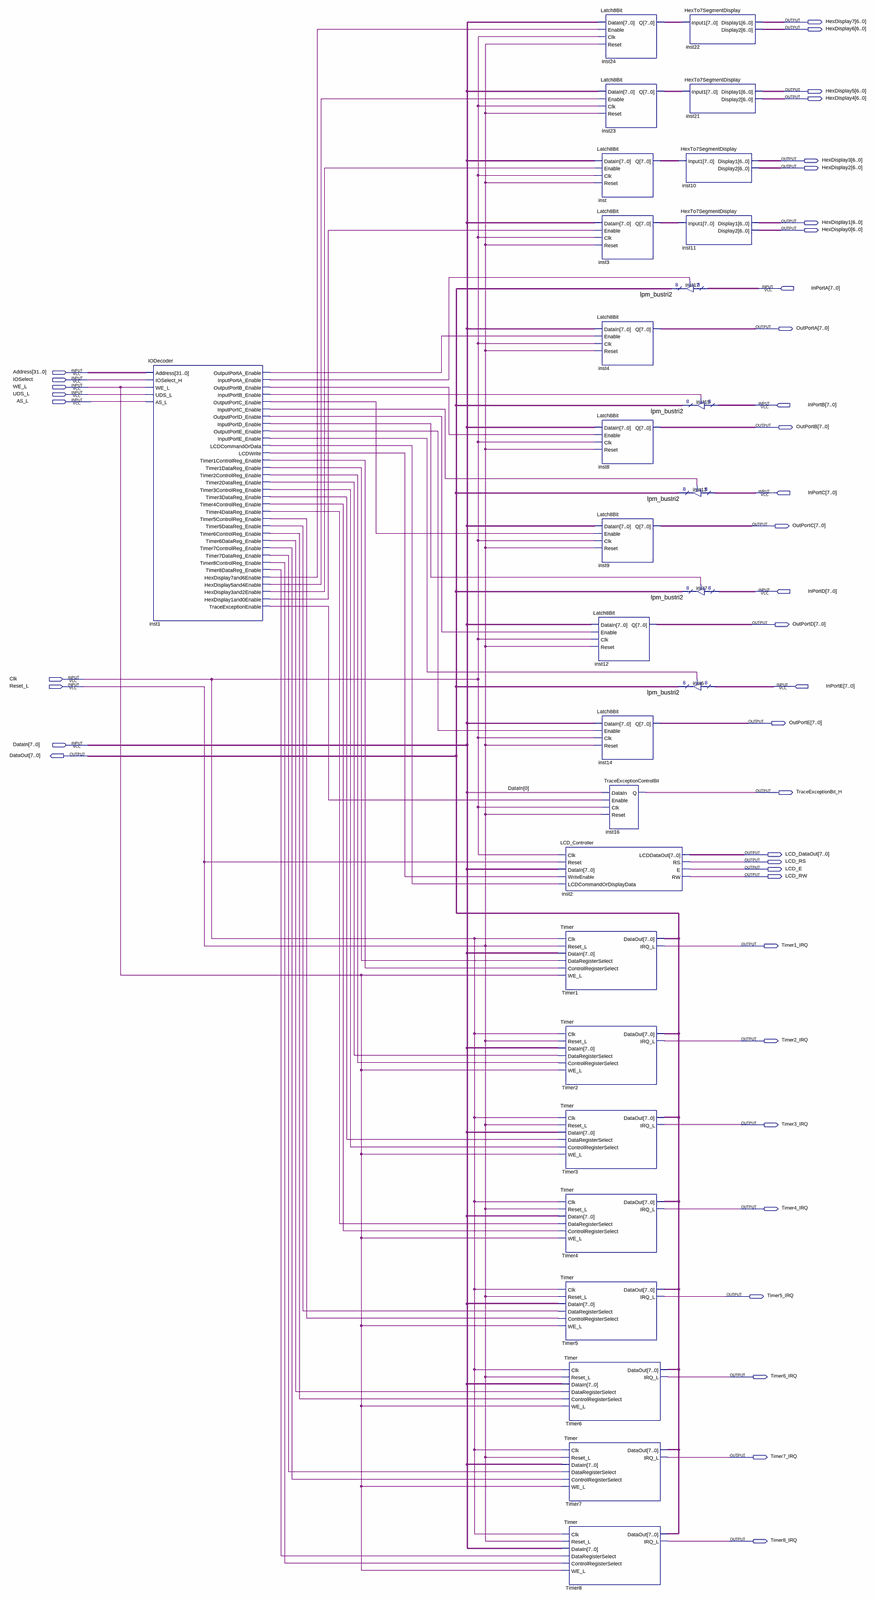
[diagram p0: schematic sheet, whole]
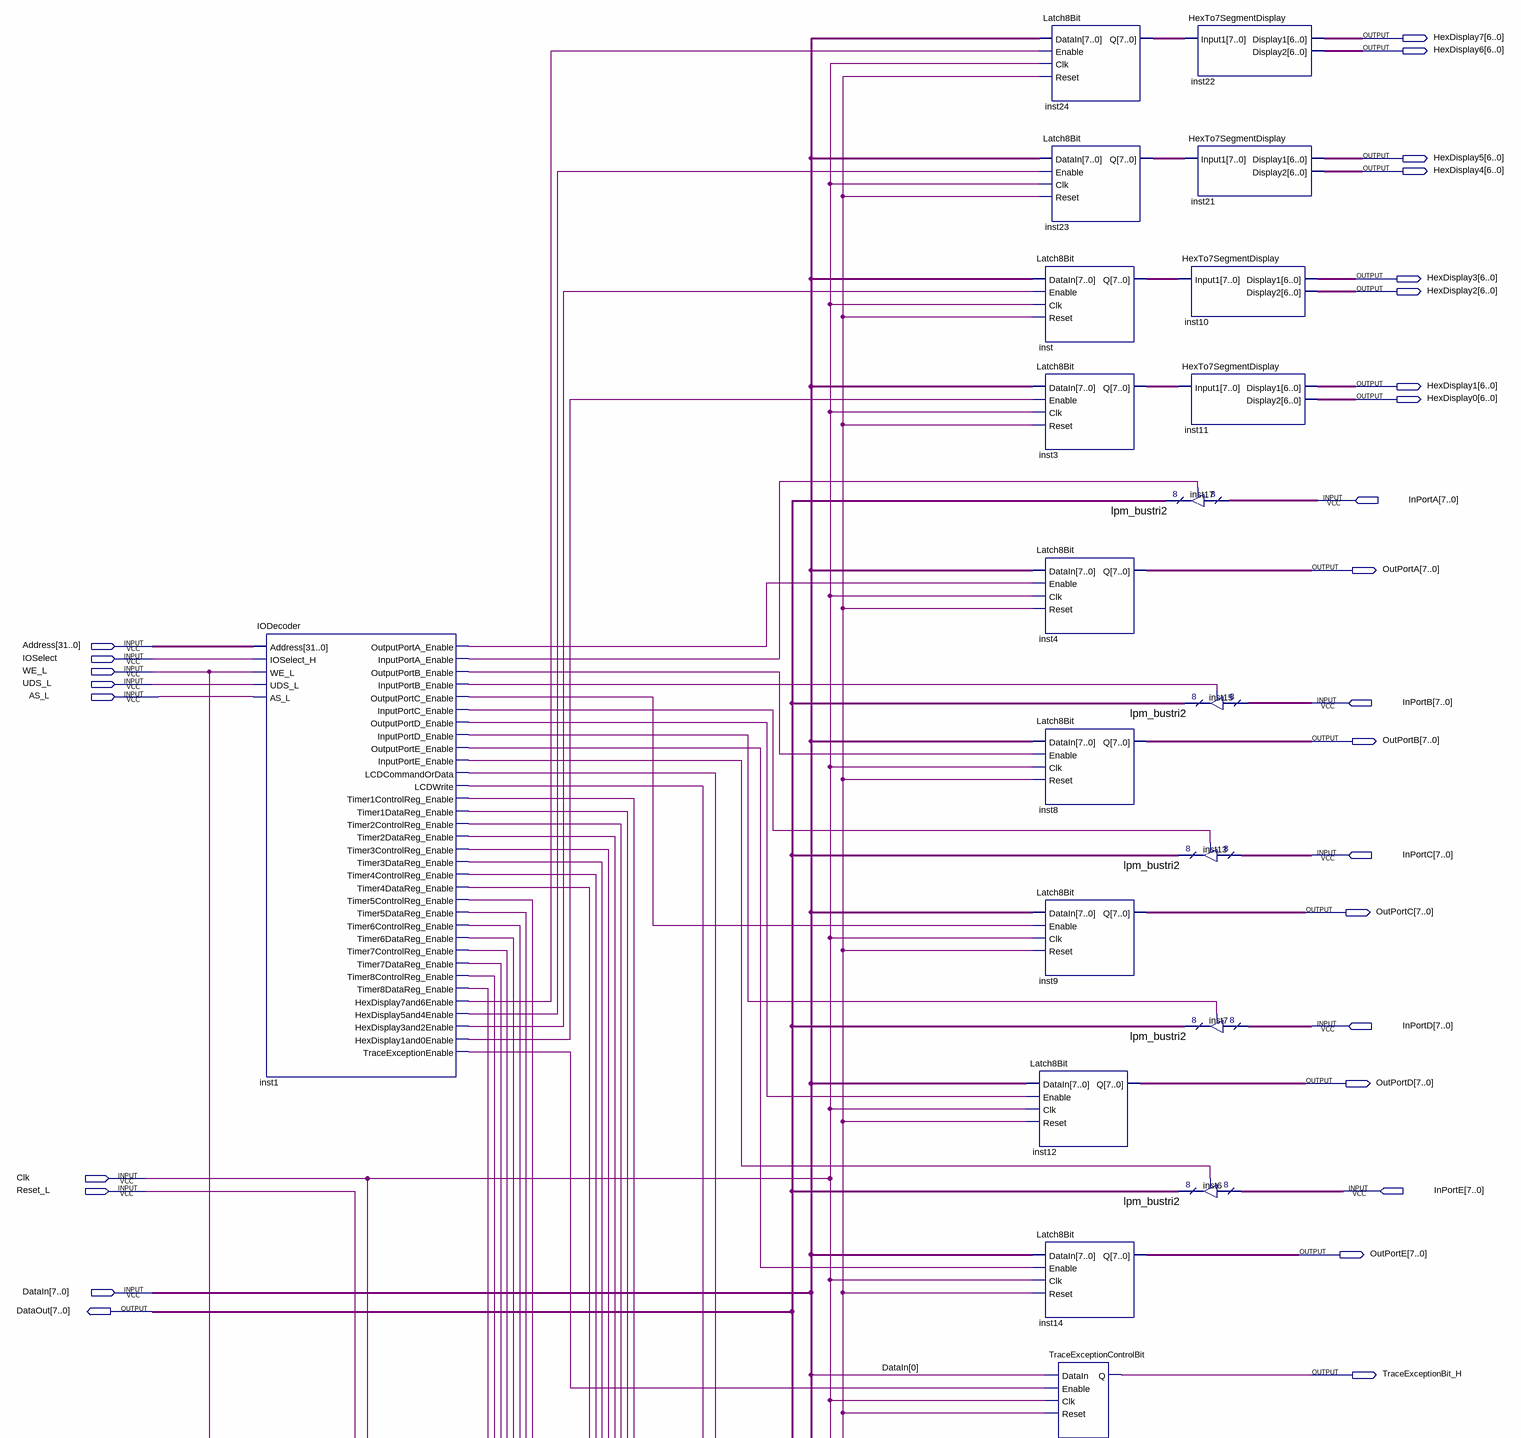
[diagram p1: schematic sheet, upper part]
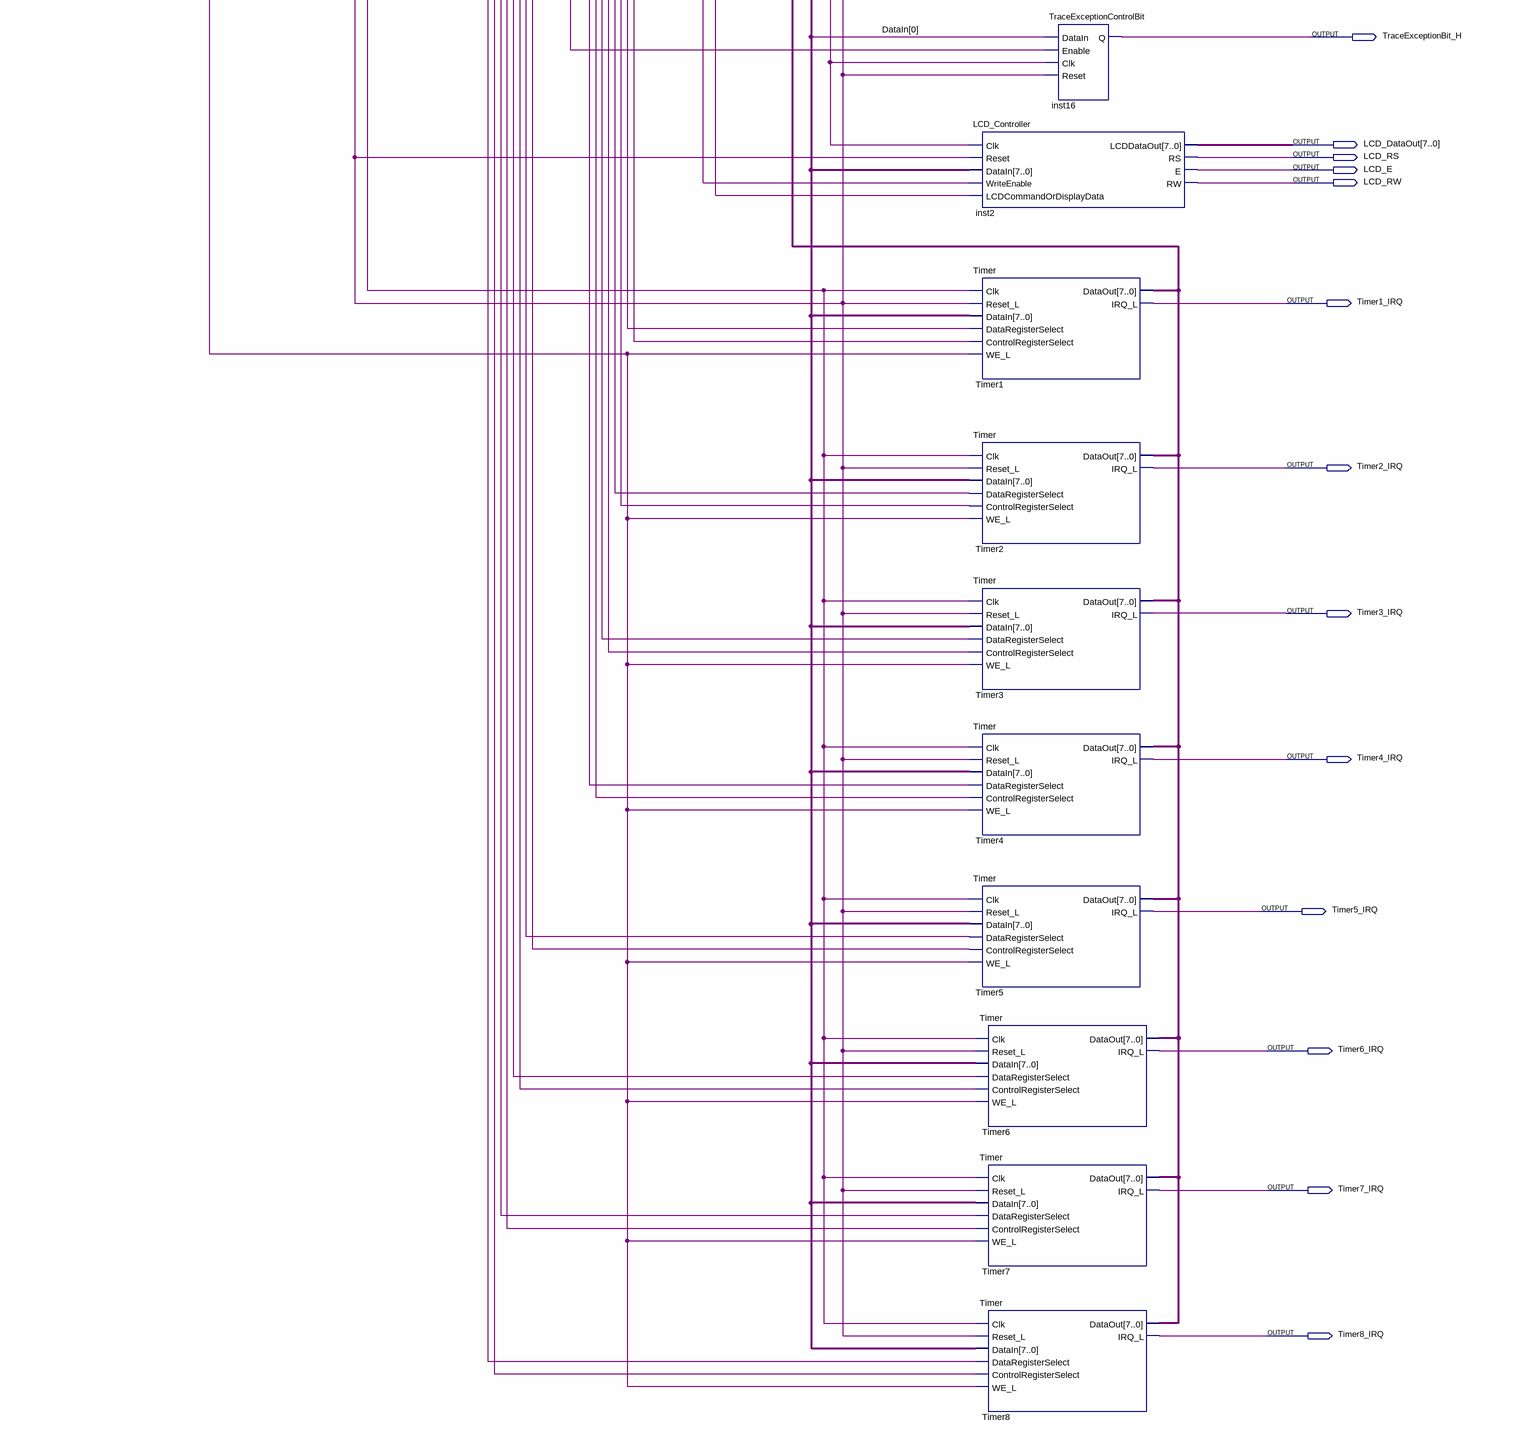
[diagram p2: schematic sheet, lower part]
// Quartus schematic OnChipIO.bdf as structural Verilog: 29 symbols, 40 pins
module OnChipIO (
  input  [7:0] InPortA,
  input  [31:0] Address,
  input  IOSelect,
  input  WE_L,
  input  UDS_L,
  input  AS_L,
  input  [7:0] InPortB,
  input  [7:0] InPortC,
  input  [7:0] InPortD,
  input  Clk,
  input  Reset_L,
  input  [7:0] InPortE,
  input  [7:0] DataIn,
  output [6:0] HexDisplay7,
  output [6:0] HexDisplay6,
  output [6:0] HexDisplay5,
  output [6:0] HexDisplay4,
  output [6:0] HexDisplay3,
  output [6:0] HexDisplay2,
  output [6:0] HexDisplay1,
  output [6:0] HexDisplay0,
  output [7:0] OutPortA,
  output [7:0] OutPortB,
  output [7:0] OutPortC,
  output [7:0] OutPortD,
  output [7:0] OutPortE,
  output [7:0] DataOut,
  output TraceExceptionBit_H,
  output [7:0] LCD_DataOut,
  output LCD_RS,
  output LCD_E,
  output LCD_RW,
  output Timer1_IRQ,
  output Timer2_IRQ,
  output Timer3_IRQ,
  output Timer4_IRQ,
  output Timer5_IRQ,
  output Timer6_IRQ,
  output Timer7_IRQ,
  output Timer8_IRQ
);

  wire inst1_hexdisplay1and0enable, inst1_hexdisplay3and2enable, inst1_hexdisplay5and4enable,
       inst1_hexdisplay7and6enable, inst1_inputporta_enable, inst1_inputportb_enable,
       inst1_inputportc_enable, inst1_inputportd_enable, inst1_inputporte_enable, inst1_lcdcommandordata,
       inst1_lcdwrite, inst1_outputporta_enable, inst1_outputportb_enable, inst1_outputportc_enable,
       inst1_outputportd_enable, inst1_outputporte_enable, inst1_timer1controlreg_enable,
       inst1_timer1datareg_enable, inst1_timer2controlreg_enable, inst1_timer2datareg_enable,
       inst1_timer3controlreg_enable, inst1_timer3datareg_enable, inst1_timer4controlreg_enable,
       inst1_timer4datareg_enable, inst1_timer5controlreg_enable, inst1_timer5datareg_enable,
       inst1_timer6controlreg_enable, inst1_timer6datareg_enable, inst1_timer7controlreg_enable,
       inst1_timer7datareg_enable, inst1_timer8controlreg_enable, inst1_timer8datareg_enable,
       inst1_traceexceptionenable;
  wire [7:0] inst3_q, inst23_q, inst24_q, inst_q;

  IODecoder inst1 (
    .Address(Address), .IOSelect_H(IOSelect), .WE_L(WE_L), .UDS_L(UDS_L), .AS_L(AS_L),
    .OutputPortA_Enable(inst1_outputporta_enable), .InputPortA_Enable(inst1_inputporta_enable),
    .OutputPortB_Enable(inst1_outputportb_enable), .InputPortB_Enable(inst1_inputportb_enable),
    .OutputPortC_Enable(inst1_outputportc_enable), .InputPortC_Enable(inst1_inputportc_enable),
    .OutputPortD_Enable(inst1_outputportd_enable), .InputPortD_Enable(inst1_inputportd_enable),
    .OutputPortE_Enable(inst1_outputporte_enable), .InputPortE_Enable(inst1_inputporte_enable),
    .LCDCommandOrData(inst1_lcdcommandordata), .LCDWrite(inst1_lcdwrite),
    .Timer1ControlReg_Enable(inst1_timer1controlreg_enable),
    .Timer1DataReg_Enable(inst1_timer1datareg_enable),
    .Timer2ControlReg_Enable(inst1_timer2controlreg_enable),
    .Timer2DataReg_Enable(inst1_timer2datareg_enable),
    .Timer3ControlReg_Enable(inst1_timer3controlreg_enable),
    .Timer3DataReg_Enable(inst1_timer3datareg_enable),
    .Timer4ControlReg_Enable(inst1_timer4controlreg_enable),
    .Timer4DataReg_Enable(inst1_timer4datareg_enable),
    .Timer5ControlReg_Enable(inst1_timer5controlreg_enable),
    .Timer5DataReg_Enable(inst1_timer5datareg_enable),
    .Timer6ControlReg_Enable(inst1_timer6controlreg_enable),
    .Timer6DataReg_Enable(inst1_timer6datareg_enable),
    .Timer7ControlReg_Enable(inst1_timer7controlreg_enable),
    .Timer7DataReg_Enable(inst1_timer7datareg_enable),
    .Timer8ControlReg_Enable(inst1_timer8controlreg_enable),
    .Timer8DataReg_Enable(inst1_timer8datareg_enable), .HexDisplay7and6Enable(inst1_hexdisplay7and6enable),
    .HexDisplay5and4Enable(inst1_hexdisplay5and4enable), .HexDisplay3and2Enable(inst1_hexdisplay3and2enable),
    .HexDisplay1and0Enable(inst1_hexdisplay1and0enable), .TraceExceptionEnable(inst1_traceexceptionenable));
  LCD_Controller inst2 (
    .Clk(Clk), .Reset(Reset_L), .DataIn(DataIn), .WriteEnable(inst1_lcdwrite),
    .LCDCommandOrDisplayData(inst1_lcdcommandordata), .LCDDataOut(LCD_DataOut), .RS(LCD_RS), .E(LCD_E),
    .RW(LCD_RW));
  Timer Timer1 (
    .Clk(Clk), .Reset_L(Reset_L), .DataIn(DataIn), .DataRegisterSelect(inst1_timer1datareg_enable),
    .ControlRegisterSelect(inst1_timer1controlreg_enable), .WE_L(WE_L), .DataOut(DataOut), .IRQ_L(Timer1_IRQ));
  Timer Timer2 (
    .Clk(Clk), .Reset_L(Reset_L), .DataIn(DataIn), .DataRegisterSelect(inst1_timer2datareg_enable),
    .ControlRegisterSelect(inst1_timer2controlreg_enable), .WE_L(WE_L), .DataOut(DataOut), .IRQ_L(Timer2_IRQ));
  Timer Timer3 (
    .Clk(Clk), .Reset_L(Reset_L), .DataIn(DataIn), .DataRegisterSelect(inst1_timer3datareg_enable),
    .ControlRegisterSelect(inst1_timer3controlreg_enable), .WE_L(WE_L), .DataOut(DataOut), .IRQ_L(Timer3_IRQ));
  Timer Timer4 (
    .Clk(Clk), .Reset_L(Reset_L), .DataIn(DataIn), .DataRegisterSelect(inst1_timer4datareg_enable),
    .ControlRegisterSelect(inst1_timer4controlreg_enable), .WE_L(WE_L), .DataOut(DataOut), .IRQ_L(Timer4_IRQ));
  Timer Timer5 (
    .Clk(Clk), .Reset_L(Reset_L), .DataIn(DataIn), .DataRegisterSelect(inst1_timer5datareg_enable),
    .ControlRegisterSelect(inst1_timer5controlreg_enable), .WE_L(WE_L), .DataOut(DataOut), .IRQ_L(Timer5_IRQ));
  Timer Timer6 (
    .Clk(Clk), .Reset_L(Reset_L), .DataIn(DataIn), .DataRegisterSelect(inst1_timer6datareg_enable),
    .ControlRegisterSelect(inst1_timer6controlreg_enable), .WE_L(WE_L), .DataOut(DataOut), .IRQ_L(Timer6_IRQ));
  Timer Timer7 (
    .Clk(Clk), .Reset_L(Reset_L), .DataIn(DataIn), .DataRegisterSelect(inst1_timer7datareg_enable),
    .ControlRegisterSelect(inst1_timer7controlreg_enable), .WE_L(WE_L), .DataOut(DataOut), .IRQ_L(Timer7_IRQ));
  Timer Timer8 (
    .Clk(Clk), .Reset_L(Reset_L), .DataIn(DataIn), .DataRegisterSelect(inst1_timer8datareg_enable),
    .ControlRegisterSelect(inst1_timer8controlreg_enable), .WE_L(WE_L), .DataOut(DataOut), .IRQ_L(Timer8_IRQ));
  Latch8Bit inst24 (.DataIn(DataIn), .Enable(inst1_hexdisplay7and6enable), .Clk(Clk), .Reset(Reset_L), .Q(inst24_q));
  Latch8Bit inst23 (.DataIn(DataIn), .Enable(inst1_hexdisplay5and4enable), .Clk(Clk), .Reset(Reset_L), .Q(inst23_q));
  Latch8Bit inst (.DataIn(DataIn), .Enable(inst1_hexdisplay3and2enable), .Clk(Clk), .Reset(Reset_L), .Q(inst_q));
  Latch8Bit inst3 (.DataIn(DataIn), .Enable(inst1_hexdisplay1and0enable), .Clk(Clk), .Reset(Reset_L), .Q(inst3_q));
  Latch8Bit inst4 (.DataIn(DataIn), .Enable(inst1_outputporta_enable), .Clk(Clk), .Reset(Reset_L), .Q(OutPortA));
  Latch8Bit inst8 (.DataIn(DataIn), .Enable(inst1_outputportb_enable), .Clk(Clk), .Reset(Reset_L), .Q(OutPortB));
  Latch8Bit inst9 (.DataIn(DataIn), .Enable(inst1_outputportc_enable), .Clk(Clk), .Reset(Reset_L), .Q(OutPortC));
  Latch8Bit inst12 (.DataIn(DataIn), .Enable(inst1_outputportd_enable), .Clk(Clk), .Reset(Reset_L), .Q(OutPortD));
  Latch8Bit inst14 (.DataIn(DataIn), .Enable(inst1_outputporte_enable), .Clk(Clk), .Reset(Reset_L), .Q(OutPortE));
  TraceExceptionControlBit inst16 (
    .DataIn(DataIn[0]), .Enable(inst1_traceexceptionenable), .Clk(Clk), .Reset(Reset_L),
    .Q(TraceExceptionBit_H));
  HexTo7SegmentDisplay inst22 (.Input1(inst24_q), .Display1(HexDisplay7), .Display2(HexDisplay6));
  HexTo7SegmentDisplay inst21 (.Input1(inst23_q), .Display1(HexDisplay5), .Display2(HexDisplay4));
  HexTo7SegmentDisplay inst10 (.Input1(inst_q), .Display1(HexDisplay3), .Display2(HexDisplay2));
  HexTo7SegmentDisplay inst11 (.Input1(inst3_q), .Display1(HexDisplay1), .Display2(HexDisplay0));
  lpm_bustri2 inst17 (.enabledt(inst1_inputporta_enable), .data(InPortA), .tridata(DataOut));
  lpm_bustri2 inst15 (.enabledt(inst1_inputportb_enable), .data(InPortB), .tridata(DataOut));
  lpm_bustri2 inst13 (.enabledt(inst1_inputportc_enable), .data(InPortC), .tridata(DataOut));
  lpm_bustri2 inst7 (.enabledt(inst1_inputportd_enable), .data(InPortD), .tridata(DataOut));
  lpm_bustri2 inst6 (.enabledt(inst1_inputporte_enable), .data(InPortE), .tridata(DataOut));
endmodule
